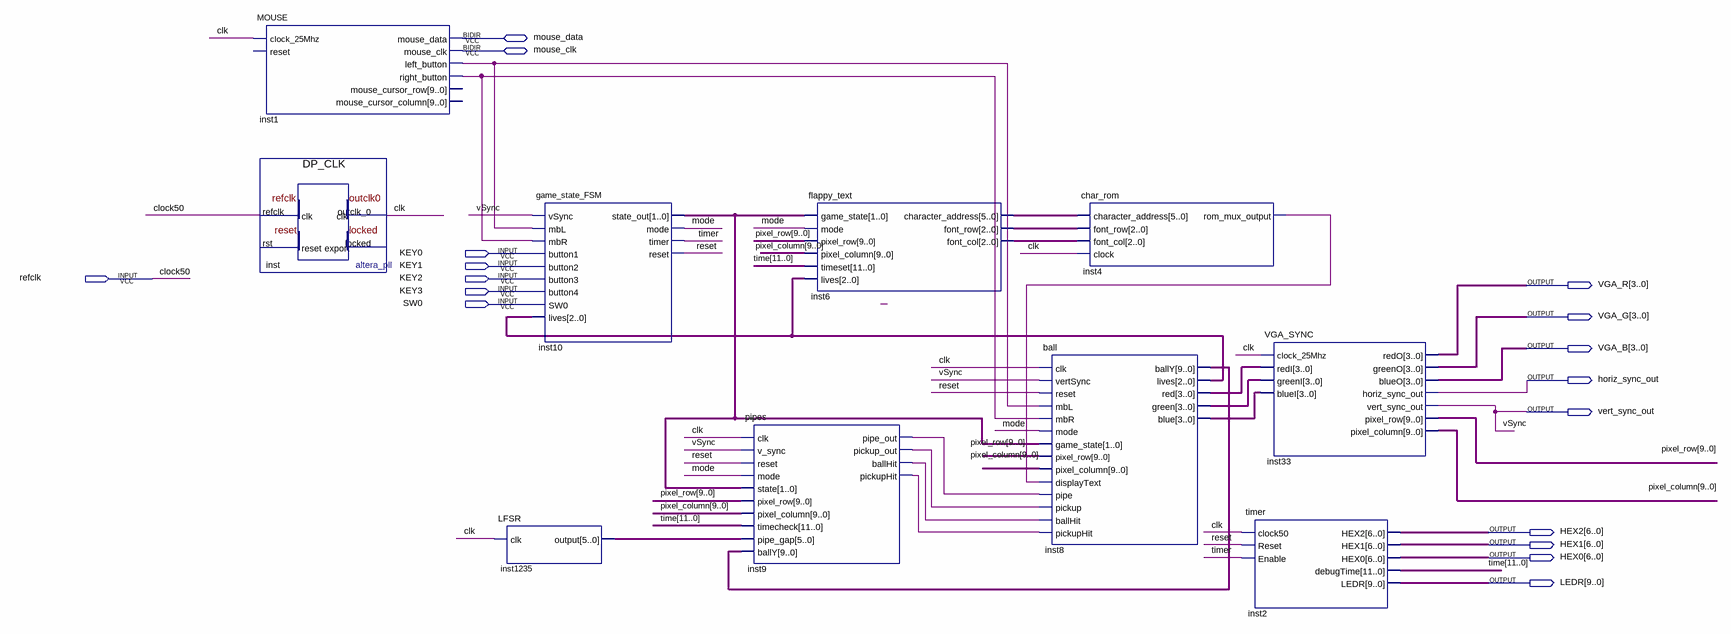
[diagram p0: schematic sheet]
// Quartus schematic main_dd.bdf as structural Verilog: 10 symbols, 17 pins
module main_dd (
  input  KEY0,
  input  KEY1,
  input  refclk,
  input  KEY2,
  input  KEY3,
  input  SW0,
  inout  mouse_data,
  inout  mouse_clk,
  output [3:0] VGA_R,
  output [3:0] VGA_G,
  output [3:0] VGA_B,
  output horiz_sync_out,
  output vert_sync_out,
  output [6:0] HEX2,
  output [6:0] HEX1,
  output [6:0] HEX0,
  output [9:0] LEDR
);

  wire clk, inst1_left_button, inst1_right_button, inst4_rom_mux_output, inst9_ballhit, inst9_pickup_out,
       inst9_pickuphit, inst9_pipe_out, mode, reset, timer;
  wire [1:0] inst10_state_out;
  wire [2:0] inst6_font_col, inst6_font_row, inst8_lives;
  wire [3:0] inst8_blue, inst8_green, inst8_red;
  wire [5:0] inst6_character_address, inst1235_output;
  wire [9:0] inst8_bally, pixel_column, pixel_row;
  wire [11:0] \time ;

  MOUSE inst1 (
    .clock_25Mhz(clk), .left_button(inst1_left_button), .right_button(inst1_right_button),
    .mouse_data(mouse_data), .mouse_clk(mouse_clk));  // open: reset, mouse_cursor_row, mouse_cursor_column
  DP_CLK inst (.refclk(refclk), .outclk_0(clk));  // open: rst, locked
  LFSR inst1235 (.clk(clk), .\output (inst1235_output));
  game_state_FSM inst10 (
    .vSync(vert_sync_out), .mbL(inst1_left_button), .mbR(inst1_right_button), .button1(KEY0), .button2(KEY1),
    .button3(KEY2), .button4(KEY3), .SW0(SW0), .lives(inst8_lives), .state_out(inst10_state_out),
    .mode(mode), .timer(timer), .reset(reset));
  pipes inst9 (
    .clk(clk), .v_sync(vert_sync_out), .reset(reset), .mode(mode), .state(inst10_state_out),
    .pixel_row(pixel_row), .pixel_column(pixel_column), .timecheck(\time ), .pipe_gap(inst1235_output),
    .ballY(inst8_bally), .pipe_out(inst9_pipe_out), .pickup_out(inst9_pickup_out), .ballHit(inst9_ballhit),
    .pickupHit(inst9_pickuphit));
  flappy_text inst6 (
    .game_state(inst10_state_out), .mode(mode), .pixel_row(pixel_row), .pixel_column(pixel_column),
    .timeset(\time ), .lives(inst8_lives), .character_address(inst6_character_address),
    .font_row(inst6_font_row), .font_col(inst6_font_col));
  char_rom inst4 (
    .character_address(inst6_character_address), .font_row(inst6_font_row), .font_col(inst6_font_col),
    .clock(clk), .rom_mux_output(inst4_rom_mux_output));
  ball inst8 (
    .clk(clk), .vertSync(vert_sync_out), .reset(reset), .mbL(inst1_left_button), .mbR(inst1_right_button),
    .mode(mode), .game_state(inst10_state_out), .pixel_row(pixel_row), .pixel_column(pixel_column),
    .displayText(inst4_rom_mux_output), .pipe(inst9_pipe_out), .pickup(inst9_pickup_out),
    .ballHit(inst9_ballhit), .pickupHit(inst9_pickuphit), .ballY(inst8_bally), .lives(inst8_lives),
    .red(inst8_red), .green(inst8_green), .blue(inst8_blue));
  VGA_SYNC inst33 (
    .clock_25Mhz(clk), .redI(inst8_red), .greenI(inst8_green), .blueI(inst8_blue), .redO(VGA_R),
    .greenO(VGA_G), .blueO(VGA_B), .horiz_sync_out(horiz_sync_out), .vert_sync_out(vert_sync_out),
    .pixel_row(pixel_row), .pixel_column(pixel_column));
  timer inst2 (
    .clock50(clk), .Reset(reset), .Enable(timer), .HEX2(HEX2), .HEX1(HEX1), .HEX0(HEX0), .debugTime(\time ),
    .LEDR(LEDR));

  // Other names for the same wires on the sheet: clock50 = refclk; vSync = vert_sync_out
endmodule
